# Altium schematic sheet TI_92_main.SchDoc: Keyboard
size A; Organization: Altium Limited; Address1: L3, 12a Rodborough Rd; Address2: Frenchs Forest; Address3: NSW; Address4: Australia 2086; SheetNumber: 1
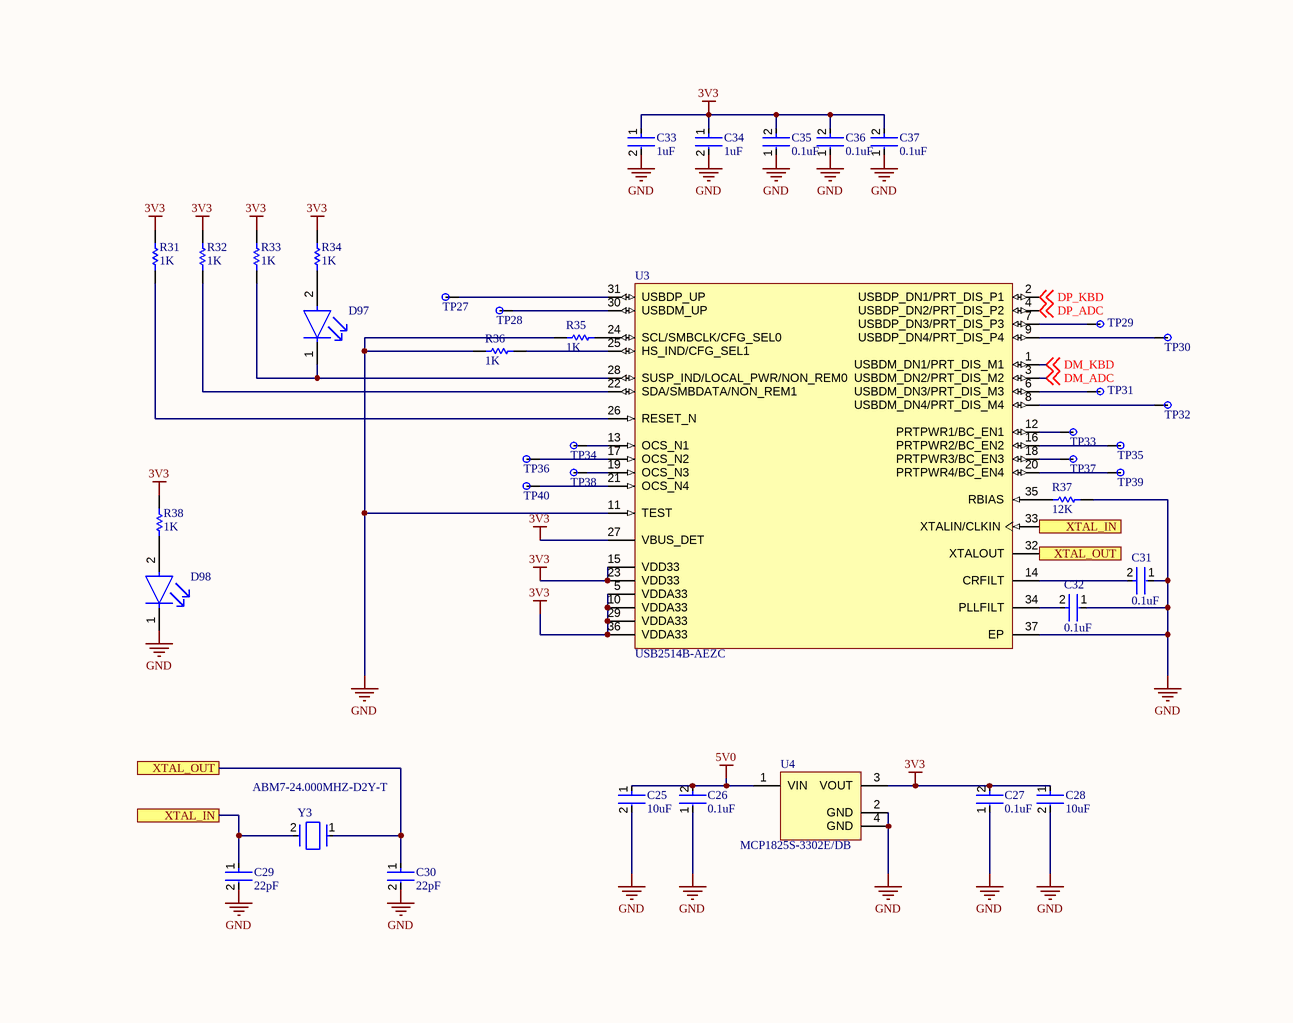
[diagram p0: TI_92_main.SchDoc]

## Parts
C25  10uF  [FP-0603-L_1_6_0_2-W_0_8_0-MFG]
C26  0.1uF  [FP-GRM15-MFG]
C27  0.1uF  [FP-GRM15-MFG]
C28  10uF  [FP-0603-L_1_6_0_2-W_0_8_0-MFG]
C29  22pF  [FP-0402-L_1_0_1-W_0_5_0_1-MFG]
C30  22pF  [FP-C0402C105K8PACTU-MFG]
C31  0.1uF  [FP-GRM15-MFG]
C32  0.1uF  [FP-GRM15-MFG]
C33  1uF  [FP-C0402C105K8PACTU-MFG]
C34  1uF  [FP-C0402C105K8PACTU-MFG]
C35  0.1uF  [FP-GRM15-MFG]
C36  0.1uF  [FP-GRM15-MFG]
C37  0.1uF  [FP-GRM15-MFG]
D97  APHHS1005CGCK  [FP-APHHS1005CGCK-MFG]  (value not drawn)
D98  APHHS1005CGCK  [FP-APHHS1005CGCK-MFG]  (value not drawn)
R31  1K  [RESC1005X40X25NL05T10]
R32  1K  [RESC1005X40X25NL05T10]
R33  1K  [RESC1005X40X25NL05T10]
R34  1K  [RESC1005X40X25NL05T10]
R35  1K  [RESC1005X40X25NL05T10]
R36  1K  [RESC1005X40X25NL05T10]
R37  12K  [RESC1005X40X25NL05T10]
R38  1K  [RESC1005X40X25NL05T10]
TP27  Test Pad  [2.5MM_PAD]  (value not drawn)
TP28  Test Pad  [2.5MM_PAD]  (value not drawn)
TP29  Test Pad  [2.5MM_PAD]  (value not drawn)
TP30  Test Pad  [2.5MM_PAD]  (value not drawn)
TP31  Test Pad  [2.5MM_PAD]  (value not drawn)
TP32  Test Pad  [2.5MM_PAD]  (value not drawn)
TP33  Test Pad  [1.0mm_Pad]  (value not drawn)
TP34  Test Pad  [1.0mm_Pad]  (value not drawn)
TP35  Test Pad  [1.0mm_Pad]  (value not drawn)
TP36  Test Pad  [1.0mm_Pad]  (value not drawn)
TP37  Test Pad  [1.0mm_Pad]  (value not drawn)
TP38  Test Pad  [1.0mm_Pad]  (value not drawn)
TP39  Test Pad  [1.0mm_Pad]  (value not drawn)
TP40  Test Pad  [1.0mm_Pad]  (value not drawn)
U3  USB2514B-AEZC  [MCHP-QFN-36_V]
U4  MCP1825S-3302E/DB  [SOT-223-DB3_N]
Y3  ABM7-24.000MHZ-D2Y-T  [FP-ABM7-MFG]

## Ports
XTAL_IN, XTAL_OUT

## Nets
3V3: C27.2 C28.1 C33.1 C34.1 C35.2 C36.2 C37.2 R31.2 R32.2 R33.2 R34.2 R38.2 U3.5(VDDA33) U3.10(VDDA33) U3.15(VDD33) U3.23(VDD33) U3.27(VBUS_DET) U3.29(VDDA33) U3.36(VDDA33) U4.3(VOUT)
5V0: C25.1 C26.2 U4.1(VIN)
GND: C25.2 C26.1 C27.1 C28.2 C29.2 C30.2 C31.1 C32.1 C33.2 C34.2 C35.1 C36.1 C37.1 D98.1(C) R35.2 R36.2 R37.2 U3.11(TEST) U3.37(EP) U4.2(GND) U4.4(GND)
DM_ADC: U3.3(USBDM_DN2/PRT_DIS_M2) ; off-sheet DM_ADC
DM_KBD: U3.1(USBDM_DN1/PRT_DIS_M1) ; off-sheet DM_KBD
DP_ADC: U3.4(USBDP_DN2/PRT_DIS_P2) ; off-sheet DP_ADC
DP_KBD: U3.2(USBDP_DN1/PRT_DIS_P1) ; off-sheet DP_KBD
XTAL_IN: C29.1 U3.33(XTALIN/CLKIN) Y3.2 ; port XTAL_IN
XTAL_OUT: C30.1 U3.32(XTALOUT) Y3.1 ; port XTAL_OUT
NetC31_2: C31.2 U3.14(CRFILT)
NetC32_2: C32.2 U3.34(PLLFILT)
NetD97_1: D97.1(C) R33.1 U3.28(SUSP_IND/LOCAL_PWR/NON_REM0)
NetD97_2: D97.2(A) R34.1
NetD98_2: D98.2(A) R38.1
NetR31_1: R31.1 U3.26(RESET_N)
NetR32_1: R32.1 U3.22(SDA/SMBDATA/NON_REM1)
NetR35_1: R35.1 U3.24(SCL/SMBCLK/CFG_SEL0)
NetR36_1: R36.1 U3.25(HS_IND/CFG_SEL1)
NetR37_1: R37.1 U3.35(RBIAS)
NetTP27_1: TP27.1(PAD) U3.31(USBDP_UP)
NetTP28_1: TP28.1(PAD) U3.30(USBDM_UP)
NetTP29_1: TP29.1(PAD) U3.7(USBDP_DN3/PRT_DIS_P3)
NetTP30_1: TP30.1(PAD) U3.9(USBDP_DN4/PRT_DIS_P4)
NetTP31_1: TP31.1(PAD) U3.6(USBDM_DN3/PRT_DIS_M3)
NetTP32_1: TP32.1(PAD) U3.8(USBDM_DN4/PRT_DIS_M4)
NetTP33_1: TP33.1(PAD) U3.12(PRTPWR1/BC_EN1)
NetTP34_1: TP34.1(PAD) U3.13(OCS_N1)
NetTP35_1: TP35.1(PAD) U3.16(PRTPWR2/BC_EN2)
NetTP36_1: TP36.1(PAD) U3.17(OCS_N2)
NetTP37_1: TP37.1(PAD) U3.18(PRTPWR3/BC_EN3)
NetTP38_1: TP38.1(PAD) U3.19(OCS_N3)
NetTP39_1: TP39.1(PAD) U3.20(PRTPWR4/BC_EN4)
NetTP40_1: TP40.1(PAD) U3.21(OCS_N4)

## Notes on the sheet
- DWG. NO.
- REV.
- SHT.
- THIS DOCUMENT AND THE DATA DISCLOSED HEREIN OR HEREWITH IS THE PROPERTY OF ALTIUM LIMITED AND MAY BE FREELY DISTRIBUTED IN WHOLE. NO RIGHTS ARE RESERVED OR EXPRESS OR IMPLIED WARANTEE GIVEN.
- REVISION
- DESCRIPTION
- DATE
- APPROVED
- ENG:
- APPROVALS
- PROJECT
- DSN:
- CHK:
- REFERENCE DOCUMENTS
- PROJECT REVISION:
- TITLE
- DOCUMENT REVISION:
- DESIGN ITEM:
- BOM:
- FAB DWG:
- PCB DWG:
- ASSY DWG:
- SCALE:
- SIZE
- B
- CAGE CODE
- FILE NAME
- DWG NO.
- SHEET
- OF
- REV

## Library data of the parts
C25 C28 = CMP-14477-005164-2: Multilayer Ceramic Capacitor 10uF 25V X5R 20% SMD 0603 T/R; Capacitance: 10uF; Packaging: Tape and Reel; Tolerance: 20%; Mount: Surface Mount; Case Code (Metric): 1608; Case Code (Imperial): 0603; Min Operating Temperature: -55°C; Lead Free: Lead Free; RoHS Compliant: Yes; Case/Package: 0603; Max Operating Temperature: 85°C; Voltage Rating: 25V
C26 C27 C31 C32 C35-C37 = CMP-2100-03641-2: CAP CER 0.1UF 16V X7R 0402; Manufacturer Part Number: GRM155R71C104KA88D; Manufacturer: Murata; Standoff Height: 0mm; Tolerance: 10%; Voltage Rating: 16Vdc; Material: Ceramic; Capacitance: 0.10μF; Value: 0.10μF; RoHS: TRUE; Temperature Characteristic: X7R; Octopart: https://octopart.com/grm155r71c104ka88d-murata-196880; Digikey Description: CAP CER 0.1UF 16V X7R 0402; Device Class L3: Ceramic Capacitors; Height: 0.55mm; ComponentLink2Description: Datasheet; Temperature Range Low: -55°C; Ipc Land Pattern Name: CAPC10050X219; ComponentLink2URL: https://search.murata.co.jp/Ceramy/image/img/A01X/G101/ENG/GRM155R71H471KA01-01A.pdf; Device Class L1: Passive Components; Lead Free: yes; Category: Cap; Package: GRM15; Temperature: -55°C to +125°C; Device Class L2: Capacitors; Temperature Range High: +125°C; Mouser Description: 0402 0.1 uF 16V ±10 % Tolerance X7R SMT Multilayer Ceramic Capacitor
C29 = CMP-2008-02613-2: General Purpose Ceramic Capacitor, 0402, 22pF, 5%, C0G, 30ppm/°C, 50V; Temperature Coefficient: 30ppm/°C; Mount: Surface Mount; Length: 1mm; Construction: Flat; Contact Plating: Tin; REACH SVHC: No SVHC; Case/Package: 0402; Voltage: 50V; Case Code (Imperial): 0402; Thickness: 0.022inch; Radiation Hardening: No; Number of Pins: 2; Tolerance: 5%; Max Operating Temperature: 125°C; RoHS Compliant: Yes; Voltage Rating: 50V; Case Code (Metric): 1005; Package Quantity: 1; Width: 0.02inch; Termination: SMD/SMT; Lead Free: Lead Free; Height: 0.5mm; Voltage Rating (DC): 50V; Capacitance: 22pF; Min Operating Temperature: -55°C; Series: -; Depth: 0.5mm; Dielectric: C0G; Packaging: Tape and Reel
C30 C33 C34 = CMP-2008-02081-2: CAP CER 1UF 10V X5R 0402; Dielectric Material: Ceramic; Dissipation Factor: 5%; Tolerance: 10%; Number of Pins: 2; Contact Plating: Tin; Min Operating Temperature: -55°C; Termination: SMD/SMT; Lead Free: Lead Free; Construction: Flat; Voltage Rating (DC): 10V; Mount: Surface Mount; Series: C; Thickness: 0.022inch; Width: 0.5mm; Radiation Hardening: No; Capacitance: 1uF; Dielectric: X5R; Height: 0.5mm; Voltage: 10V; Length: 1mm; Depth: 0.5mm; Max Operating Temperature: 85°C; Package Quantity: 1; Packaging: Tape and Reel; RoHS Compliant: Yes; Case Code (Imperial): 0402; Case Code (Metric): 1005; REACH SVHC: No SVHC; Voltage Rating: 10V; Case/Package: 0402
D97 D98 = CMP-44529-000044-1: LED GREEN CLEAR CHIP SMD; Viewing Angle: 120°; Dominant Wavelength: 570nm; Test Current: 20mA; Luminous Intensity: 50mcd; Forward Voltage: 2.1V; Number of LEDs: 1; Lens Color: Clear; Packaging: Tape and Reel; Max Operating Temperature: 85°C; Illumination Color: Green; Length: 1mm; Mount: Surface Mount; Lens Style: Clear; Color: Green; Number of Pins: 2; Wavelength: 570nm; Case/Package: 0402; Width: 0.5mm; Package Quantity: 2000; Case Code (Metric): 1005; Height: 0.6mm; Lead Free: Lead Free; Case Code (Imperial): 0402; Forward Current: 20mA; Min Operating Temperature: -40°C
R31-R38 = CMP-2002-07472-1: Part Number: RC0402FR-071KL; Manufacturer: Yageo / Phycomp
TP27-TP40 = Test_Pad: Various Test Pads
U3 = CMP-2000-05217-1: USB 2.0 High-Speed Hub Controller, 4 Ports, 3 to 3.6 V, 0 to 85 degC, 36-Pin QFN, RoHS, Tray; Manufacturer: Microchip; Interface: I²CEEPROM,SMBus(2-Wire,I²C); Other Names: 638-1122; Voltage - Supply: 3V~3.6V; Current - Supply: 70mA; Manufacturer URL: http://www.microchip.com/; Packaging: Tray; Function: -; Standards: -; Category: IntegratedCircuits(ICs); Package / Case: 36-VFQFNExposedPad; Supplier Device Package: 36-QFN(6x6); Family: Interface-Controllers; Datasheet Version: DS00001692C, 10/2015; Standard Package: 490; Series: -; Protocol: -; Datasheet URL: http://ww1.microchip.com/downloads/en/DeviceDoc/00001692C.pdf; Operating Temperature: -
U4 = CMP-0136-00458-1: 500 mA, Low Voltage, Low Quiescent Current LDO Regulator, 3-Pin SOT-223, Extended Temperature; PackageReference: SOT-223-DB3; PackageDescription: 3-Lead Plastic Small Outline Transistor (DB) [SOT-223]; PackageVersion: revBB, Aug-2009; DatasheetVersion: revB, Feb-2008
Y3 = CMP-27762-000095-1: Crystal 16MHz ±20ppm 18pF SMD-2 6mm x 3.5mm; ESR (Equivalent Series Resistance): 50R; Frequency Stability: 30ppm; Width: 3.3mm; Frequency: 16MHz; Radiation Hardening: No; Height: 0.055inch; Tolerance: 20ppm; Length: 6mm; Case/Package: CSMD; Lead Free: Lead Free; Min Operating Temperature: -40°C; Termination: SMD/SMT; Operating Frequency: 16 MHz; Resistor Type: Ceramic; Packaging: Tape and Reel; Mount: Surface Mount; Load Capacitance: 18pF; Frequency Tolerance: 20ppm; Depth: 3.5mm; Series: ABM7; Package Quantity: 1000; Max Operating Temperature: 85°C; Number of Pins: 2